# Altium schematic sheet 401_GridPos4.SchDoc
size A2; Organization: Greenfield Tech Solutions; Address1: Molendreef 33; Address2: Ossendrecht; Address3: 4641CS; Address4: The Netherlands; SheetNumber: 3; SheetTotal: 4
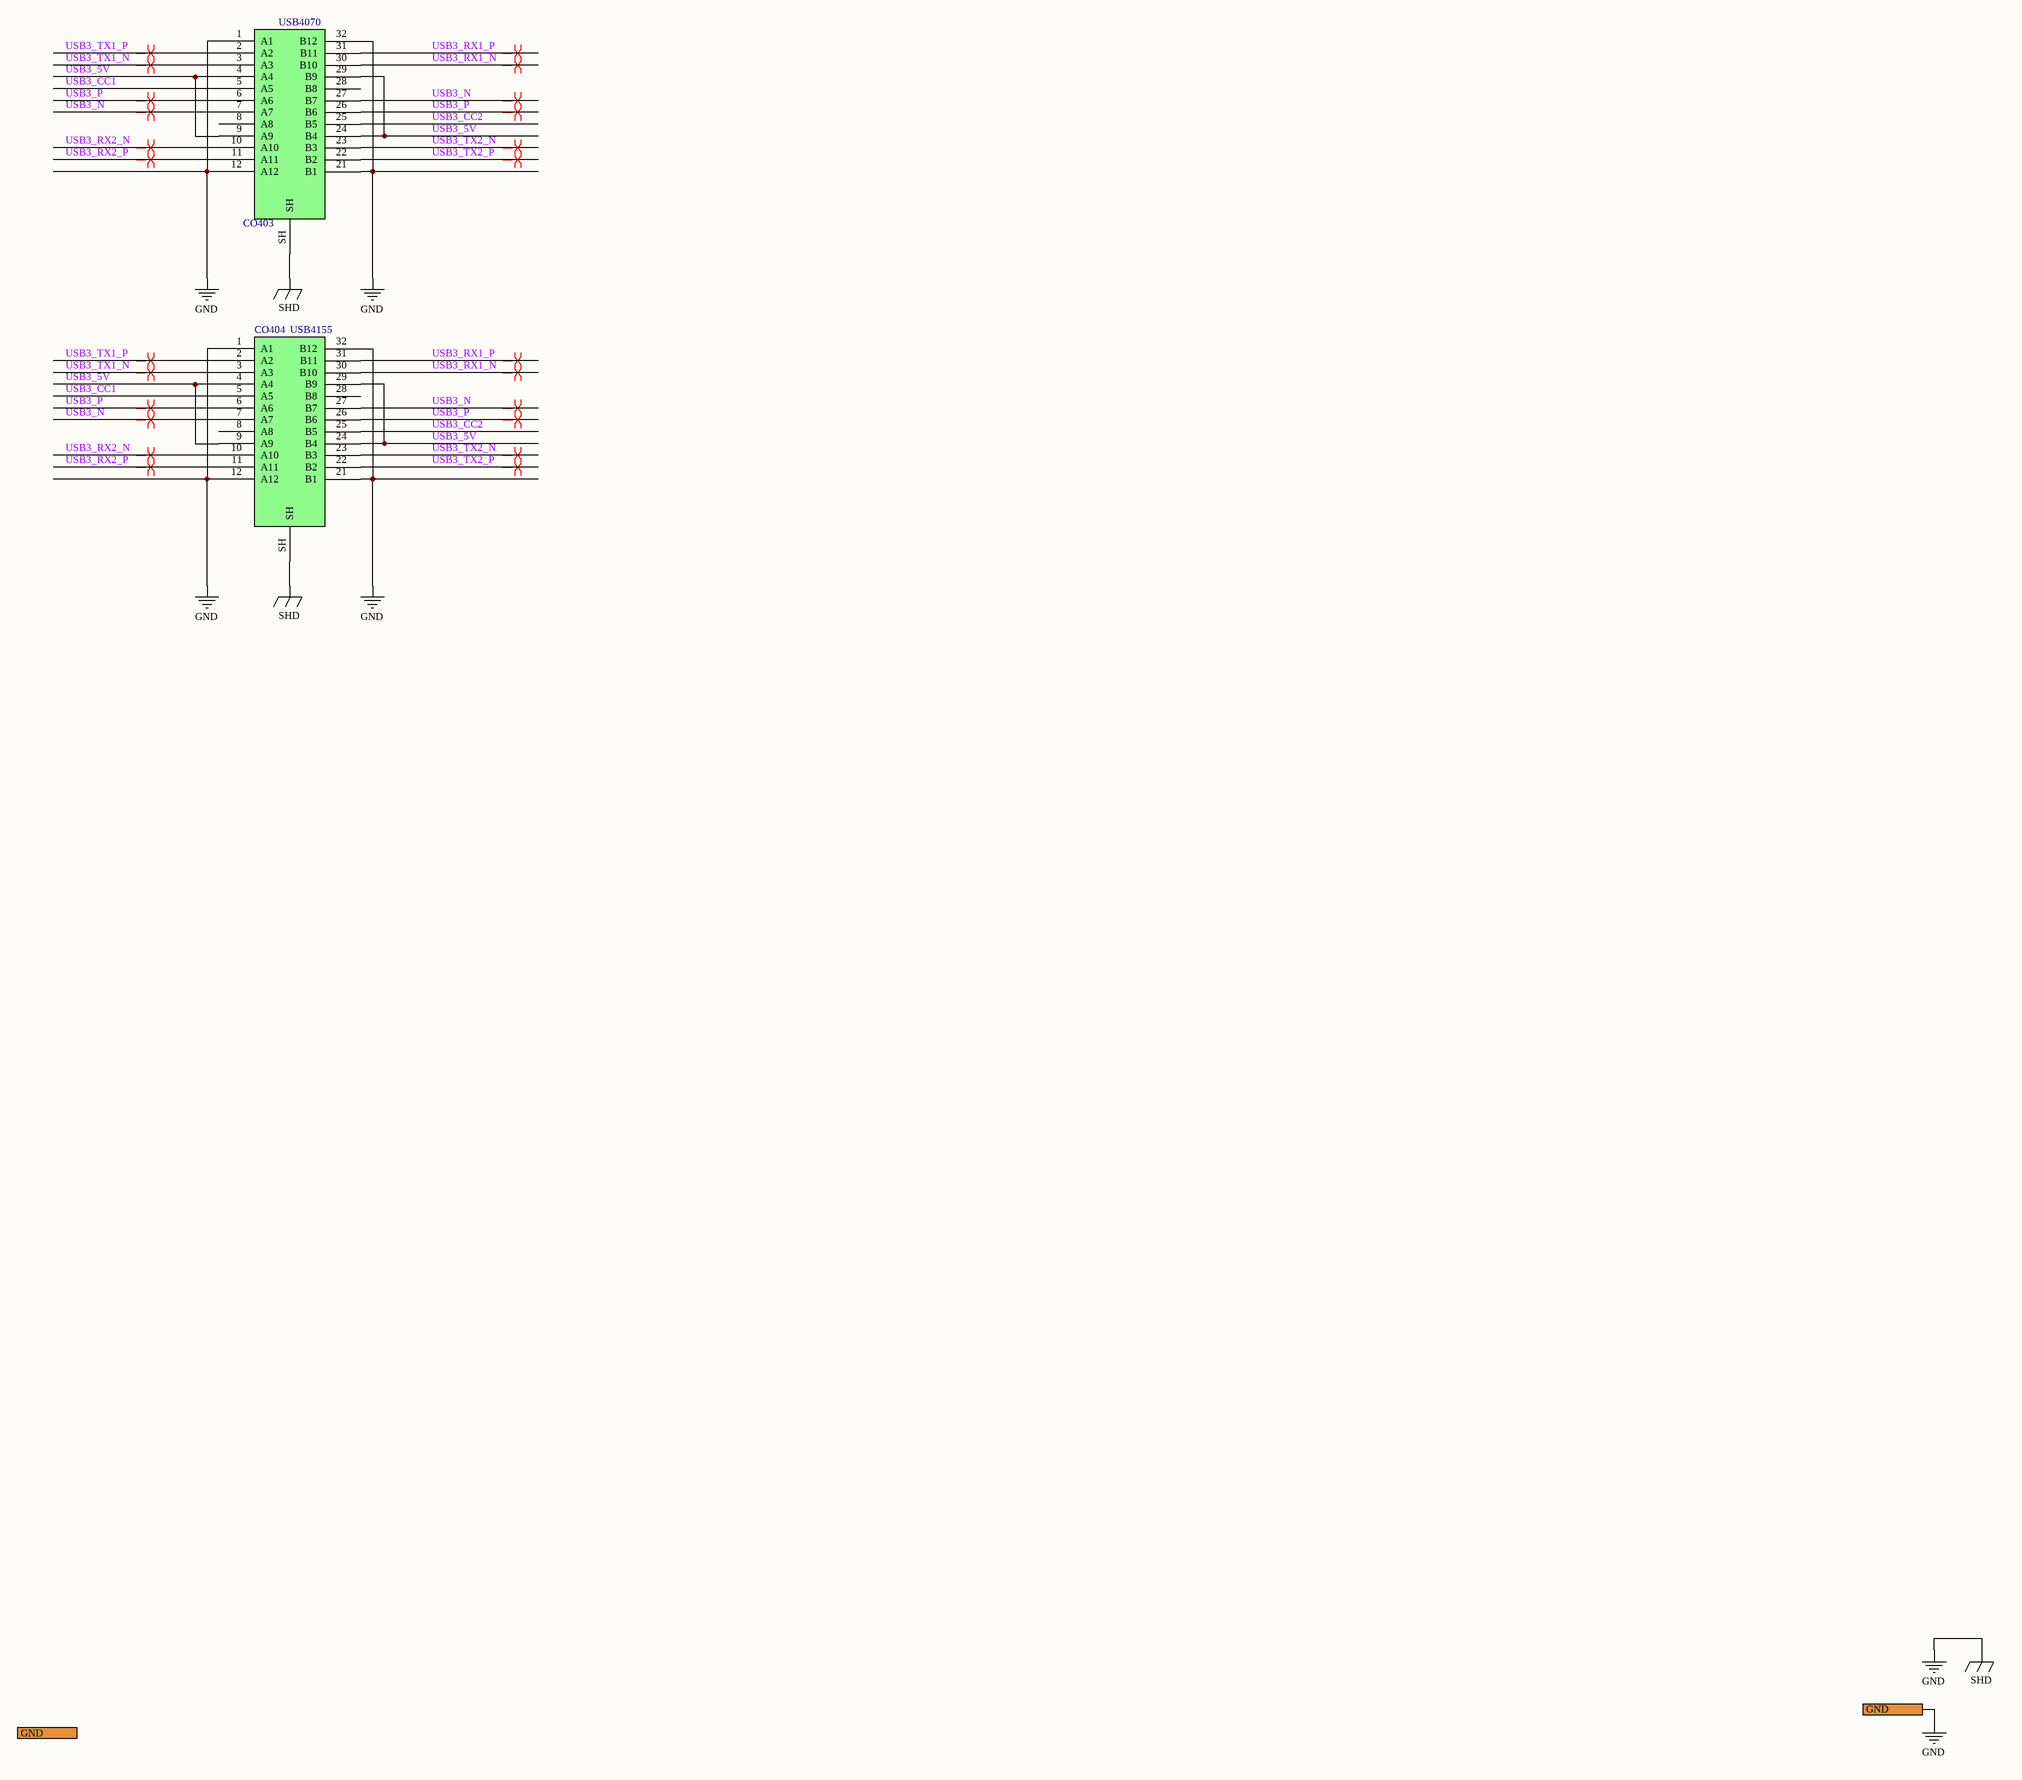
[diagram p0: 401_GridPos4.SchDoc]

## Parts
CO403  USB4070  [USB4070-30-C]
CO404  USB4155  [USB4155-03-C]

## Ports
GND

## Nets
GND: CO403.1(A1) CO403.12(A12) CO403.21(B1) CO403.32(B12) CO403.SH CO404.1(A1) CO404.12(A12) CO404.21(B1) CO404.32(B12) CO404.SH ; port GND  [also labelled SHD]
USB3_5V: CO403.4(A4) CO403.9(A9) CO403.24(B4) CO403.29(B9) CO404.4(A4) CO404.9(A9) CO404.24(B4) CO404.29(B9)
USB3_CC1: CO403.5(A5) CO404.5(A5)
USB3_CC2: CO403.25(B5) CO404.25(B5)
USB3_N: CO403.7(A7) CO403.27(B7) CO404.7(A7) CO404.27(B7)
USB3_P: CO403.6(A6) CO403.26(B6) CO404.6(A6) CO404.26(B6)
USB3_RX1_N: CO403.30(B10) CO404.30(B10)
USB3_RX1_P: CO403.31(B11) CO404.31(B11)
USB3_RX2_N: CO403.10(A10) CO404.10(A10)
USB3_RX2_P: CO403.11(A11) CO404.11(A11)
USB3_TX1_N: CO403.3(A3) CO404.3(A3)
USB3_TX1_P: CO403.2(A2) CO404.2(A2)
USB3_TX2_N: CO403.23(B3) CO404.23(B3)
USB3_TX2_P: CO403.22(B2) CO404.22(B2)

Not connected (* = marked no-connect by the designer): CO403 8(A8) 28(B8); CO404 8(A8) 28(B8)

## Layout directives
differential pair; differential pair class USB3: USB3_N, USB3_P, USB3_RX1_N, USB3_RX1_P, USB3_RX2_N, USB3_RX2_P, USB3_TX1_N, USB3_TX1_P, USB3_TX2_N, USB3_TX2_P

## Notes on the sheet
- Title
- Size:
- Date:
- File:
- A2
- Number:
- Time:
- Revision:
- Sheet
- of

## Library data of the parts
CO403 = CO0021: USB C connector Receptacle Vertical; Part Number: CO0021; ID: 16; RefVal: USB4070; ManfactPart: USB4070-30-C
CO404 = CO0031: USB C connector Plug Horizontal; Part Number: CO0031; ID: 30; RefVal: USB4155; ManfactPart: USB4155-03-C